# EAGLE schematic GPSClock (EAGLE 9.5.1)
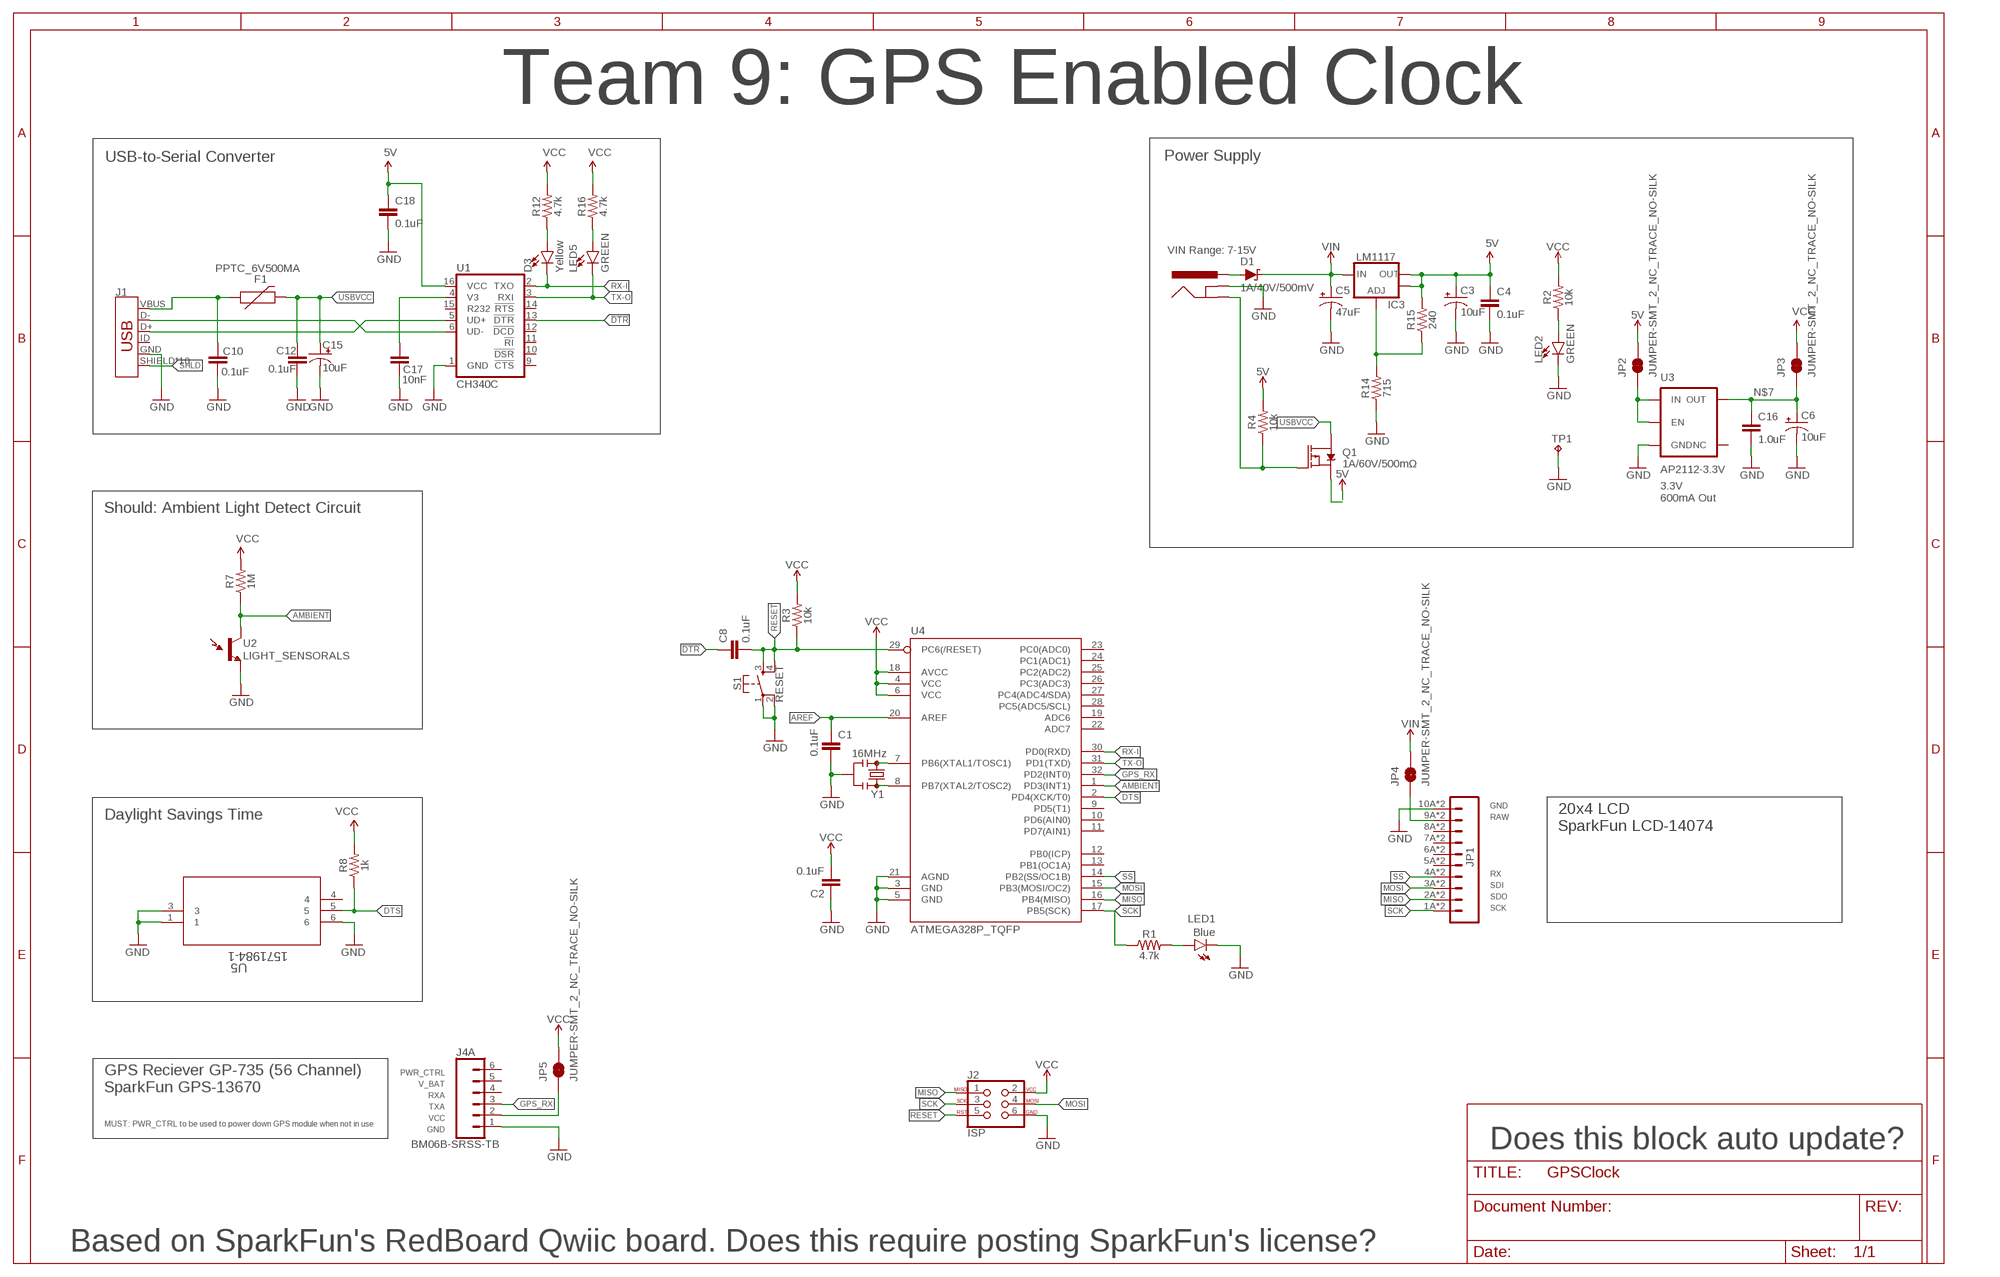
[diagram p0: schematic, sheet 1]

## Parts
C1  0.1uF  0.1UF-0603-25V-(+80/-20%)  [0603]
C2  0.1uF  0.1UF-0603-25V-(+80/-20%)  [0603]
C3  10uF  10UF-POLAR-EIA3216-16V-10%(TANT)  [EIA3216]
C4  0.1uF  0.1UF-0603-25V-(+80/-20%)  [0603]
C5  47uF  47UF-POLAR-PANASONIC_D-35V-20%  [PANASONIC_D]
C6  10uF  10UF-POLAR-EIA3216-16V-10%(TANT)  [EIA3216]
C8  0.1uF  0.1UF-0603-25V-(+80/-20%)  [0603]
C10  0.1uF  0.1UF-0603-25V-(+80/-20%)  [0603]
C12  0.1uF  0.1UF-0603-25V-(+80/-20%)  [0603]
C15  10uF  10UF-POLAR-EIA3216-16V-10%(TANT)  [EIA3216]
C16  1.0uF  1.0UF-16V-10%(0603)  [0603-CAP]
C17  10nF  10NF/10000PF-50V-10%(0603)  [0603-CAP]
C18  0.1uF  0.1UF-0603-25V-(+80/-20%)  [0603]
D1  1A/40V/500mV  DIODE-SCHOTTKY-SS14  [SMA-DIODE]
D3  Yellow  LED-YELLOW_HIDDENSILK  [LED-1206-HIDDENSILK]
F1  PPTC_6V500MA  [0805]
IC3  LM1117  V_REG_LM1117ALT1  [SOT223-ALT1]
J1  AMP FCI 10103594-0001LF  USB_MICRO-B_HALF_PTH_MILL  [USB-MICROB-PTH-MILL]
J2  ISP  AVR_SPI_PROG_3X2SMD  [2X3_SMT_POSTS]
J3  POWER_JACKSUPER_BOMB_DIGITY  [POWER_JACK_SMD_OVERPASTE_SUPER_BOMB_DIGITY]
J4  BM06B-SRSS-TB  JST_6_PIN_HORIZONTAL  [JST-6-SMD-HORI-1.0MM]
JP1  M10SMD_COMBO  [1X10_SMD_COMBINED]
JP2  JUMPER-SMT_2_NC_TRACE_NO-SILK  [SMT-JUMPER_2_NC_TRACE_NO-SILK]
JP3  JUMPER-SMT_2_NC_TRACE_NO-SILK  [SMT-JUMPER_2_NC_TRACE_NO-SILK]
JP4  JUMPER-SMT_2_NC_TRACE_NO-SILK  [SMT-JUMPER_2_NC_TRACE_NO-SILK]
JP5  JUMPER-SMT_2_NC_TRACE_NO-SILK  [SMT-JUMPER_2_NC_TRACE_NO-SILK]
LED1  Blue  LED-BLUE_HIDDENSILK  [LED-1206-HIDDENSILK]
LED2  GREEN  LED-GREEN_HIDDENSILK  [LED-1206-HIDDENSILK]
LED5  GREEN  LED-GREEN_HIDDENSILK  [LED-1206-HIDDENSILK]
Q1  1A/60V/500mΩ  MOSFET-PCH-ZXMP6A13F  [SOT23-3]
R1  4.7k  4.7KOHM-0603-1/10W-1%  [0603]
R2  10k  10KOHM-0603-1/10W-1%  [0603]
R3  10k  10KOHM-0603-1/10W-1%  [0603]
R4  10k  10KOHM-0603-1/10W-1%  [0603]
R7  1M  1MOHM-0603-1/4W-5%  [0603]
R8  1k  1KOHM-0603-1/10W-1%  [0603]
R12  4.7k  4.7KOHM-0603-1/10W-1%  [0603]
R14  715  715OHM-0603-1/10W-1%  [0603]
R15  240  240OHM-0603-1/10W-1%  [0603]
R16  4.7k  4.7KOHM-0603-1/10W-1%  [0603]
S1  RESET  MOMENTARY-SWITCH-SPST-2-SMD-5.2MM-TALL  [TACTILE_SWITCH_SMD_5.2MM]
TP1  TP-063  [TP-063]
U1  CH340C  [SO016]
U2  LIGHT_SENSORALS  [ALS-PT19]
U3  AP2112-3.3V  V_REG_AP2112K-3.3V  [SOT23-5]
U4  ATMEGA328P_TQFP  [TQFP32-08]
U5  1571984-1  [SWITCH_1571984-1]
Y1  16MHz  RESONATOR-16MHZSMD_3.2X1.3  [RESONATOR-SMD-3.2X1.3]

## Nets
5V: C3.+ C4.1 C18.1 IC3.2(OUT) IC3.4(OUT) JP2.2 Q1.2(S) R4.2 R15.2 U1.16(VCC)
!DTR: C8.1 U1.13(!DTR)
AMBIENT: R7.1 U2.C(C1) U4.1(PD3(INT1))
AREF: C1.1 U4.20(AREF)
DTS: R8.1 U4.2(PD4(XCK/T0)) U5.5
GND: C1.2 C2.1 C3.- C4.2 C5.- C6.- C10.2 C12.2 C15.- C16.2 C17.2 C18.2 J1.GND J2.6 J3.GND(GNDBREAK) J4.1 JP1.10A JP1.10B LED1.C LED2.C R14.1 S1.1 S1.2 TP1.1 U1.1(GND) U2.E(E1) U3.2(GND) U4.3(GND) U4.5(GND) U4.21(AGND) U5.1 U5.3 U5.6 Y1.2
GPS_RX: J4.3 U4.32(PD2(INT0))
INSERT: J3.P$4(GND) Q1.1(G) R4.1
MISO: J2.1 JP1.2A JP1.2B U4.16(PB4(MISO))
MOSI: J2.4 JP1.3A JP1.3B U4.15(PB3(MOSI/OC2))
N$1: LED1.A R1.2
N$2: LED2.A R2.1
N$3: U4.7(PB6(XTAL1/TOSC1)) Y1.1
N$4: U4.8(PB7(XTAL2/TOSC2)) Y1.3
N$5: LED5.A R16.1
N$6: C17.1 U1.4(V3)
N$7: C6.+ C16.1 JP3.1 U3.5(OUT)
N$8: JP2.1 U3.1(IN) U3.3(EN)
N$9: D3.A R12.1
N$10: JP1.9A JP1.9B JP4.1
N$11: J4.2 JP5.1
N$13: J1.D- U1.6(UD-)
N$14: J1.D+ U1.5(UD+)
N$15: IC3.1(ADJ) R14.2 R15.1
PWRIN: D1.A J3.VIN0(PWR)
RESET: C8.2 J2.5 R3.1 S1.3 S1.4 U4.29(PC6(/RESET))
RX-I: D3.C U1.2(TXO) U4.30(PD0(RXD))
SCK: J2.3 JP1.1A JP1.1B R1.1 U4.17(PB5(SCK))
SHLD: J1.SHIELD J1.SHIELD2(SHIELD) J1.SHIELD3(SHIELD) J1.SHIELD4(SHIELD) J1.SHIELD5(SHIELD) J1.SHIELD6(SHIELD) J1.SHIELD7(SHIELD) J1.SHIELD8(SHIELD) J1.SHIELD9(SHIELD) J1.SHIELD10(SHIELD)
SS: JP1.4A JP1.4B U4.14(PB2(SS/OC1B))
TX-O: LED5.C U1.3(RXI) U4.31(PD1(TXD))
USBVCC: C12.1 C15.+ F1.2 Q1.3(D)
VCC: C2.2 J2.2 JP3.2 JP5.2 R2.2 R3.2 R7.2 R8.2 R12.2 R16.2 U4.4(VCC) U4.6(VCC) U4.18(AVCC)
VIN: C5.+ D1.C IC3.3(IN) JP4.2
VUSB: C10.1 F1.1 J1.VBUS
Unconnected: J1.ID J4.4 J4.5 J4.6 J4.M1 J4.M2 JP1.5A JP1.5B JP1.6A JP1.6B JP1.7A JP1.7B JP1.8A JP1.8B U1.9(!CTS) U1.10(!DSR) U1.11(!RI) U1.12(!DCD) U1.14(!RTS) U1.15(R232) U3.4(NC) U4.9(PD5(T1)) U4.10(PD6(AIN0)) U4.11(PD7(AIN1)) U4.12(PB0(ICP)) U4.13(PB1(OC1A)) U4.19(ADC6) U4.22(ADC7) U4.23(PC0(ADC0)) U4.24(PC1(ADC1)) U4.25(PC2(ADC2)) U4.26(PC3(ADC3)) U4.27(PC4(ADC4/SDA)) U4.28(PC5(ADC5/SCL)) U5.4

## Notes on the sheet
- Team 9: GPS Enabled Clock
- USB-to-Serial Converter | Power Supply
- VIN Range: 7-15V
- 3.3V
  600mA Out
- Should: Ambient Light Detect Circuit
- GND
- Daylight Savings Time | RAW
- 20x4 LCD
  SparkFun LCD-14074
- RX
- SDI
- SDO
- SCK
- PWR_CTRL
- V_BAT
- GPS Reciever GP-735 (56 Channel)
  SparkFun GPS-13670
- RXA
- TXA
- VCC
- MUST: PWR_CTRL to be used to power down GPS module when not in use | GND
- Does this block auto update?
- Based on SparkFun's RedBoard Qwiic board. Does this require posting SparkFun's license?

## Library data of the parts
C1 C2 C4 C8 C10 C12 C18 = SparkFun-Capacitors:0.1UF: 0.1µF ceramic capacitors A capacitor is a passive two-terminal electrical component used to store electrical energy temporarily in an electric field.; PROD_ID: CAP-00810
C3 C6 C15 = SparkFun-Capacitors:10UF-POLAR: 10.0µF polarized capacitors A capacitor is a passive two-terminal electrical component used to store electrical energy temporarily in an electric field.; PROD_ID: CAP-00811
C5 = SparkFun-Capacitors:47UF-POLAR: 47µF polarized capacitors A capacitor is a passive two-terminal electrical component used to store electrical energy temporarily in an electric field.; PROD_ID: CAP-08478
C16 = SparkFun-Capacitors:1.0UF-16V-10%(0603): CAP-00868; PROD_ID: CAP-00868
C17 = SparkFun-Capacitors:10NF/10000PF-50V-10%(0603): CAP-00867; PROD_ID: CAP-00867
D1 = SparkFun-DiscreteSemi:DIODE-SCHOTTKY: Schottky diode A Schottky diode is a semiconductor diode which has a low forward voltage drop and a very fast switching action.; PROD_ID: DIO-08053
D3 = SparkFun-LED:LED-YELLOW: Yellow SMD LED Used in manufacturing several products at SparkFun. Packages: 0603 - SMD 0603 package[Product Link] <http://www.kingbrightusa.com/product.asp?catalog_name=LED&product_id=APT1608SYCK> 0603 -SMART - SMART SMD 0603 package (more efficient/more expensive) [Product Link] <http://www.osram-os.com/osram_os/en/products/product-catalog/led-light-emitting-diodes/smartled-0603/ly-l29k/index.jsp> LilyPad - SMD1206 package[Product Datasheet] <https://www.sparkfun.com/datasheets/DevTools/LilyPad/Q150YUS4.pdf> SparkFun Products: Blynk Board <https://www.sparkfun.com/products/13794> IOIO-OTG <https://www.sparkfun.com/products/13613> XBee Explorer Serial <https://www.sparkfun.com/products/13225>; PROD_ID: DIO-09909
F1 = SparkFun-Fuses:PPTC: Resettable Fuse PPTC Resettable Fuse. Really a sort of resistor with a polymeric positive temperature coefficient whose resistance increases dramatically with an increase in temperature. When heated by the power passing through the resistance rises causing the current to be limited, protecting the circuit. This is achieved by the transition of the polymer from a crystalline to an amorphous state where the conductive carbon separates breaking the conductive pathways found in the cool crystalline structure. When a PPTC cools back down it resumes conducting letting the circuit turn back on. SparkFun Products: SparkFun RedBoard - Programmed with Arduino <https://www.sparkfun.com/products/12757> Pro Micro - 5V/16MHz <https://www.sparkfun.com/products/12640> Arduino Pro 328 - 5V/16MHz <https://www.sparkfun.com/products/10915> MP3 Trigger <https://www.sparkfun.com/products/13720>
IC3 = Testing:V_REG_LM1117: Voltage Regulator LM1117 Standard adjustable voltage regulator but in SMD form. Spark Fun Electronics SKU : COM-00595; PROD_ID: VREG-08170
J1 = SparkFun-Connectors:USB_MICRO-B: USB Type Micro-B Connector Male/female and PTH/SMT variants SparkFun Products: SparkFun microB USB Breakout <https://www.sparkfun.com/products/12035> SparkFun USB microB Plug Breakout <https://www.sparkfun.com/products/10031> SparkFun ESP8266 Thing <https://www.sparkfun.com/products/13231>; PROD_ID: CONN-13711
J2 = SparkFun-Connectors:AVR_SPI_PROG_3X2: AVR ISP 6 Pin This is the reduced ISP connector for AVR programming. Common on Arduino. This footprint will take up less PCB space and can be used with a 10-pin to 6-pin adapter such as SKU: BOB-08508 **Special note about "TEST_POINT" package. The stop mask is on the top side, so if you want your programming test points to be on the bottom of your board, make sure to place this package on the bottom side of the board. This also ensure that the orientation to program from the bottom side will be correct.; PROD_ID: CONN-11415
J3 = Testing:POWER_JACK: Power Jack This is the standard 5.5mm barrel jack for power. The PTH is the most common, proven, reliable, footprint. All others are experimental. The Slot footprint only works if the mill layer is transmitted to the PCB fab house so be warned. Spark Fun Electronics SKU : PRT-00119. Mating wall wart : TOL-00298 (and others); PROD_ID: CONN-08106
J4 = SparkFun-Connectors:JST_6_PIN_HORIZONTAL: JST 6 pin horizontal connector JST-SH type. Here is the connector we sell at SparkFun: name <link> (XXX-00000) Datasheet <http://www.sparkfun.com/datasheets/GPS/EM406-SMDConnector-eSH.pdf> It was used on these SparkFun products: name <link> (XXX-00000) name <link> (XXX-00000); PROD_ID: XXX-00000
JP1 = SparkFun-Connectors:M10: Header 10 Standard 10-pin 0.1" header. Use with straight break away headers (SKU : PRT-00116), right angle break away headers (PRT-00553), swiss pins (PRT-00743), machine pins (PRT-00117), and female headers (PRT-00115).; PROD_ID: CONN-11219
JP2-JP5 = SparkFun-Jumpers:JUMPER-SMT_2_NC_TRACE: Normally closed trace jumper This jumper has a trace between two pads so it's normally closed (NC). Use a razor knife to open the connection. For best results follow the IPC guidelines for cutting traces: Cutout at least 0.063 mm (0.005 in). Remove all loose material to clean up the cut area. Seal the cut with an approved epoxy. Reapply solder to reclose the connection.
LED1 = SparkFun-LED:LED-BLUE: Blue SMD LED Used in manufacturing of various products at SparkFun Packages: 0603 - SMD 0603 package [Product Link] <http://www.digikey.com/product-detail/en/SMLE12BC7TT86/511-1589-2-ND/1641808> 1206 - SMD1206 package [Product Link] <http://www.digikey.com/product-detail/en/lite-on-inc/LTST-C150TBKT/160-1643-1-ND/573584> SparkFun Products: ESP8266 Thing-Dev Board <https://www.sparkfun.com/products/13711> RedBoard <https://www.sparkfun.com/products/12757>; PROD_ID: DIO-09911
LED2 = SparkFun-LED:LED-GREEN: Green SMD LED Used in manufacturing of various products at SparkFun Packages: 0603 - SMD 0603 package [Product Link] <http://www.futureelectronics.com/en/technologies/semiconductors/optoelectronics/leds/Pages/9894312-LTST-C190GKT.aspx?CrossPart=HSMG-C190&IM=0> LilyPad 1206 - SMD1206 LilyPad package [Product Link] <http://www.futureelectronics.com/en/Technologies/Product.aspx?ProductID=IN150NGHARVATEKCORPORATION2049943&IM=0> 1206 - SMD1206 package [Product Link] <http://www.futureelectronics.com/en/technologies/semiconductors/optoelectronics/leds/Pages/8315665-LTST-C150KGKT.aspx?IM=0> 1206 Bottom Mount -SMD 1206 Bottom Mount [Product Link] <http://www.digikey.com/product-detail/en/lite-on-inc/LTST-C230KGKT/160-1456-1-ND/386854> SparkFun Products: Pro Mini 328 -5V <https://www.sparkfun.com/products/821> RedBoard <https://www.sparkfun.com/products/12757> MP3 Trigger <https://www.sparkfun.com/products/13720> Makey Makey <https://www.sparkfun.com/products/11076>; PROD_ID: DIO-09910
LED5 = SparkFun-LED:LED-GREEN: Green SMD LED Used in manufacturing of various products at SparkFun Packages: 0603 - SMD 0603 package [Product Link] <http://www.futureelectronics.com/en/technologies/semiconductors/optoelectronics/leds/Pages/9894312-LTST-C190GKT.aspx?CrossPart=HSMG-C190&IM=0> LilyPad 1206 - SMD1206 LilyPad package [Product Link] <http://www.futureelectronics.com/en/Technologies/Product.aspx?ProductID=IN150NGHARVATEKCORPORATION2049943&IM=0> 1206 - SMD1206 package [Product Link] <http://www.futureelectronics.com/en/technologies/semiconductors/optoelectronics/leds/Pages/8315665-LTST-C150KGKT.aspx?IM=0> 1206 Bottom Mount -SMD 1206 Bottom Mount [Product Link] <http://www.digikey.com/product-detail/en/lite-on-inc/LTST-C230KGKT/160-1456-1-ND/386854> SparkFun Products: Pro Mini 328 -5V <https://www.sparkfun.com/products/821> RedBoard <https://www.sparkfun.com/products/12757> MP3 Trigger <https://www.sparkfun.com/products/13720> Makey Makey <https://www.sparkfun.com/products/11076>; PROD_ID: DIO-00862
Q1 = SparkFun-DiscreteSemi:MOSFET-PCH: P-channel MOSFETs Voltage controlled devices that allow control of high current outputs.; PROD_ID: TRANS-08285
R1 R12 R16 = SparkFun-Resistors:4.7KOHM: 4.7kΩ resistor A resistor is a passive two-terminal electrical component that implements electrical resistance as a circuit element. Resistors act to reduce current flow, and, at the same time, act to lower voltage levels within circuits. - Wikipedia; PROD_ID: RES-07857
R2-R4 = SparkFun-Resistors:10KOHM: 10kΩ resistor A resistor is a passive two-terminal electrical component that implements electrical resistance as a circuit element. Resistors act to reduce current flow, and, at the same time, act to lower voltage levels within circuits. - Wikipedia; PROD_ID: RES-00824
R7 = SparkFun-Resistors:1MOHM: 1MΩ resistor A resistor is a passive two-terminal electrical component that implements electrical resistance as a circuit element. Resistors act to reduce current flow, and, at the same time, act to lower voltage levels within circuits. - Wikipedia; PROD_ID: RES-07868
R8 = SparkFun-Resistors:1KOHM: 1kΩ resistor A resistor is a passive two-terminal electrical component that implements electrical resistance as a circuit element. Resistors act to reduce current flow, and, at the same time, act to lower voltage levels within circuits. - Wikipedia; PROD_ID: RES-07856
R14 = SparkFun-Resistors:715OHM: 715Ω resistor A resistor is a passive two-terminal electrical component that implements electrical resistance as a circuit element. Resistors act to reduce current flow, and, at the same time, act to lower voltage levels within circuits.; PROD_ID: RES-07850
R15 = SparkFun-Resistors:240OHM: 240Ω resistor A resistor is a passive two-terminal electrical component that implements electrical resistance as a circuit element. Resistors act to reduce current flow, and, at the same time, act to lower voltage levels within circuits.; PROD_ID: RES-07849
S1 = SparkFun-Switches:MOMENTARY-SWITCH-SPST-2: Momentary Switch (Pushbutton) - SPST - Two Circuits Normally-open (NO) SPST momentary switches (buttons, pushbuttons). Schematic symbol includes two switch circuits. Variants SMD-4.6MMX2.8MM - 4.60mm x 2.80mm Tactile Momentary Button Switch - Used on SparkFun SAMD21 Mini Breakout <https://www.sparkfun.com/products/13664> SMD-5.2MM - Mini Pushbutton Switch - SMD <https://www.sparkfun.com/products/8720> - Used on Arduino Pro Mini <https://www.sparkfun.com/products/11114>; PROD_ID: SWCH-14139
TP1 = keystone:TP: TEST POINT PCB Vertical Mount
U1 = SparkFun-IC-Comms:CH340C; PROD_ID: IC-14038
U2 = SparkFun-Sensors:LIGHT_SENSOR: Ambient Light Sensors - Phototransistors Low cost ambient light sensors, consisting of a phototransistor in miniature SMD packages. Output voltage varies with light intensity. SparkFun Products ALS-PT19 Light Sensor <https://www.sparkfun.com/products/12566> (SEN-12566) Ambient Light Sensor - TEMT6000 <https://www.sparkfun.com/products/8348> (SEN-08348) SparkFun Ambient Light Sensor Breakout - TEMT60000 <https://www.sparkfun.com/products/8688> (SEN-08688); PROD_ID: IC-11836; SF_ID: SEN-12566
U3 = SparkFun-PowerIC:V_REG_AP2112: AP2112 - 600mA CMOS LDO Regulator w/ Enable The AP2112 is CMOS process low dropout linear regulator with enable function, the regulator delivers a guaranteed 600mA (min.) continuous load current. Features Output Voltage Accuracy: ±1.5% Output Current: 600mA (Min.) Foldback Short Current Protection: 50mA Enable Function to Turn ON/OFF VOUT Low Dropout Voltage (3.3V): 250mV (Typ.) @IOUT=600mA Excellent Load Regulation: 0.2%/A (Typ.) Excellent Line Regulation: 0.02%/V (Typ.) Low Quiescent Current: 55μA (Typ.) Low Standby Current: 0.01μA (Typ.) Low Output Noise: 50μVRMS PSRR: 100Hz -65dB, 1kHz -65dB OTSD Protection Stable with 1.0μF Flexible Cap: Ceramic, Tantalum and Aluminum Electrolytic Operation Temperature Range: -40°C to 85°C ESD: MM 400V, HBM 4000V; PROD_ID: VREG-12457; VALUE: 3.3V
U4 = SparkFun-IC-Microcontroller:ATMEGA328P_TQFP; PROD_ID: IC-09069
U5 = TE 1571984-1:1571984-1; MANUFACTURER_PART_NUMBER: 15719841; VENDOR: TE Connectivity
Y1 = SparkFun-Clocks:RESONATOR-16MHZ: 16MHz Resonator Digikey Example <http://www.digikey.com/product-detail/en/murata-electronics-north-america/CSTCE16M0V53-R0/490-1198-1-ND/584635> Frequency: 16MHz Frequency Stability: ±0.3% Frequency Tolerance: ±0.5% Capacitance: 15pF; PROD_ID: XTAL-08900

## Net classes
1 power: width 0.178 mm